# Altium schematic sheet uc.SchDoc
size A3; Organization: EPI sarl; Address1: 153 rue d'Altorf; Address2: 67120; Address3: Dachstein; Address4: France; SheetNumber: 1; SheetTotal: 2
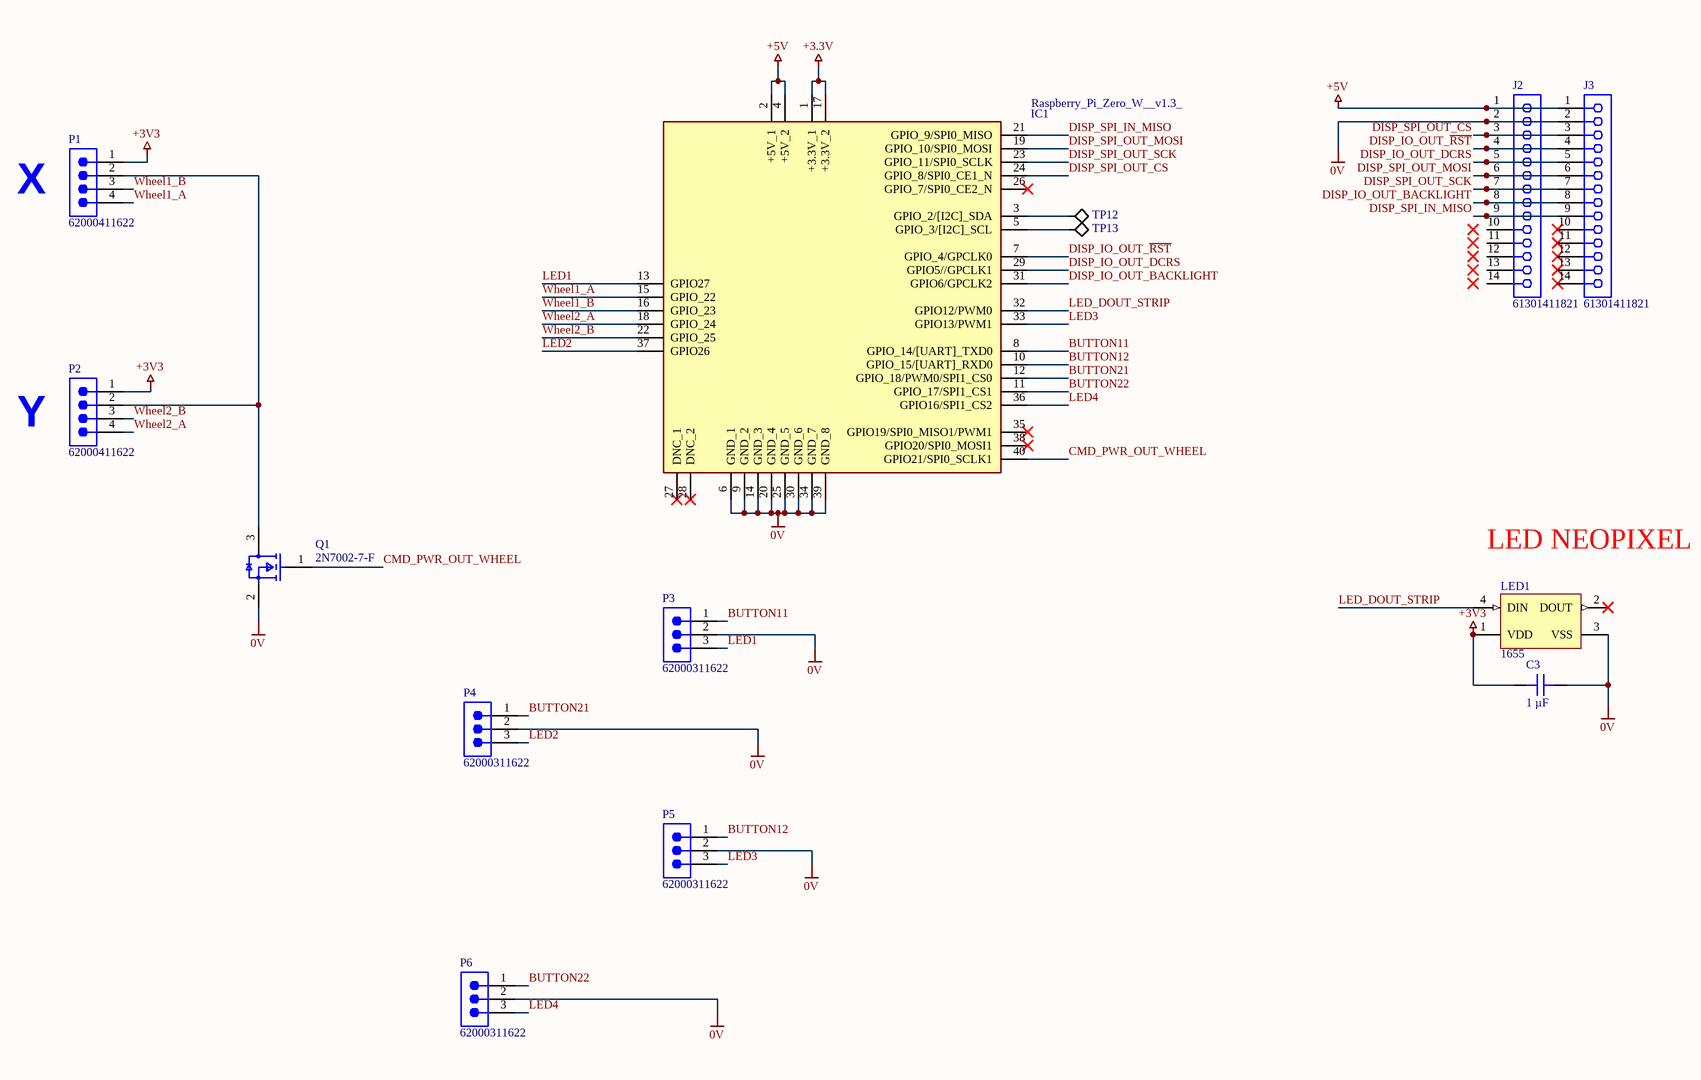
[diagram p0: uc.SchDoc]

## Parts
C3  1 µF  [CAP 0603_1608]
IC1  Raspberry_Pi_Zero_W__v1.3_  [RaspberryPiZero2W]
J2  61301411821  [61301411821]
J3  61301411821  [61301411821]
LED1  1655  [ADA-RGB-1655_V]
P1  62000411622  [62000411622]
P2  62000411622  [62000411622]
P3  62000311622  [62000311622]
P4  62000311622  [62000311622]
P5  62000311622  [62000311622]
P6  62000311622  [62000311622]
Q1  2N7002-7-F  [FP-SOT23-MFG]
TP12  Test Point  [TESTPOINT_ROUND_2.0MM]  (value not drawn)  (no BOM)
TP13  Test Point  [TESTPOINT_ROUND_2.0MM]  (value not drawn)  (no BOM)

## Nets
0V: C3.1 IC1.6(GND_1) IC1.9(GND_2) IC1.14(GND_3) IC1.20(GND_4) IC1.25(GND_5) IC1.30(GND_6) IC1.34(GND_7) IC1.39(GND_8) J2.2 J3.2 LED1.3(VSS) P3.2 P4.2 P5.2 P6.2 Q1.2(S)
+3.3V: IC1.1(+3.3V_1) IC1.17(+3.3V_2)
+3V3: C3.2 LED1.1(VDD) P1.1 P2.1
+5V: IC1.2(+5V_1) IC1.4(+5V_2) J2.1 J3.1
BUTTON11: IC1.8(GPIO_14/[UART]_TXD0) P3.1
BUTTON12: IC1.10(GPIO_15/[UART]_RXD0) P5.1
BUTTON21: IC1.12(GPIO_18/PWM0/SPI1_CS0) P4.1
BUTTON22: IC1.11(GPIO_17/SPI1_CS1) P6.1
CMD_PWR_OUT_WHEEL: IC1.40(GPIO21/SPI0_SCLK1) Q1.1(G)
DISP_IO_OUT_BACKLIGHT: IC1.31(GPIO6/GPCLK2) J2.8 J3.8
DISP_IO_OUT_DCRS: IC1.29(GPIO5//GPCLK1) J2.5 J3.5
DISP_IO_OUT_~{RST}: IC1.7(GPIO_4/GPCLK0) J2.4 J3.4
DISP_SPI_IN_MISO: IC1.21(GPIO_9/SPI0_MISO) J2.9 J3.9
DISP_SPI_OUT_CS: IC1.24(GPIO_8/SPI0_CE1_N) J2.3 J3.3
DISP_SPI_OUT_MOSI: IC1.19(GPIO_10/SPI0_MOSI) J2.6 J3.6
DISP_SPI_OUT_SCK: IC1.23(GPIO_11/SPI0_SCLK) J2.7 J3.7
LED1: IC1.13(GPIO27) P3.3
LED2: IC1.37(GPIO26) P4.3
LED3: IC1.33(GPIO13/PWM1) P5.3
LED4: IC1.36(GPIO16/SPI1_CS2) P6.3
LED_DOUT_STRIP: IC1.32(GPIO12/PWM0) LED1.4(DIN)
Wheel1_A: IC1.15(GPIO_22) P1.4
Wheel1_B: IC1.16(GPIO_23) P1.3
Wheel2_A: IC1.18(GPIO_24) P2.4
Wheel2_B: IC1.22(GPIO_25) P2.3
NetIC1_3: IC1.3(GPIO_2/[I2C]_SDA) TP12.1(TP)
NetIC1_5: IC1.5(GPIO_3/[I2C]_SCL) TP13.1(TP)
NetP1_2: P1.2 P2.2 Q1.3(D)

Not connected (* = marked no-connect by the designer): IC1 26(GPIO_7/SPI0_CE2_N)* 27(DNC_1)* 28(DNC_2)* 35(GPIO19/SPI0_MISO1/PWM1)* 38(GPIO20/SPI0_MOSI1)*; J2 10 11 12 13 14; J3 10* 11* 12* 13* 14*; LED1 2(DOUT)*

## Notes on the sheet
- (near P1) X
- (near P2) Y
- (near LED1) LED NEOPIXEL
- Unless otherwise noted, this document contains EPI® technologies information.
- Exclusive Property of EPI®
- File :
- Size:
- Date:
- A3
- Ref :
- Sheet
- of
- Reproduction, use, disclosure or transmittal of all or any part of this document is prohibited except to the explicit approved in writing by EPI® representative.
- Project :

## Library data of the parts
C3 = GCM188R71C105KA64J: CAP CER 1UF 16V X7R 0603; manufacturer: Murata Electronics; Tolerance: ±10%; Part Number: GCM188R71C105KA64J; Value: 1 µF; Applications: Automotive; Capacitance: 1 µF; componentlink1description: Datasheet; componentlink1url: https://www.murata.com/~/media/webrenewal/support/library/catalog/products/capacitor/mlcc/c03e.ashx?la=en-us; componentlink2description: DigiKey Link; componentlink2url: https://www.digikey.com/en/products/detail/murata-electronics/GCM188R71C105KA64J/4903955; Device Package: 0603 (1608 Metric); lastupdated: 08/03/2023 20:08:24; Lifecycle Status: Active; Minimum Order: 1; Mounting Type: Surface Mount, MLCC; Operating Temperature: -55°C ~ 125°C; Package / Case: 0603 (1608 Metric); packaging: TapeAndReel; partid: 13992; Part Status: Active; price: 0.02; Ratings: AEC-Q200; series: GCM; Size / Dimension: 0.063" L x 0.031" W (1.60mm x 0.80mm); Supplier 1: DigiKey; Supplier Part Number 1: 490-12657-1-ND; Temperature Coefficient: X7R; Thickness (Max): 0.035" (0.90mm); Voltage - Rated: 16V
IC1 = Raspberry_Pi_Zero_W__v1.3_: Integrated Circuit; Manufacturer_Name: RASPBERRY-PI; Manufacturer_Part_Number: Raspberry Pi Zero W (v1.3); Datasheet Link: https://cdn.sparkfun.com/assets/learn_tutorials/6/7/6/PiZero_1.pdf
J2 J3 = CMP-1502-01341-2: NexarPartId: 61924734; Gender: Female; Current Rating: 3A; Operating Supply Voltage: 250V; Contact Resistance: 20mΩ; RoHS: Non-Compliant; Number of Pins: 14; Orientation: Vertical; Lead Pitch: 2.54mm
LED1 = CMP-2000-05026-1: Intelligent Control LED Integrated Light Source, 3.5 to 5.3 V, -25 to 80 degC, 4-Pin SMD, RoHS, Tape and Reel; Manufacturer: Adafruit-Industries-LLC; Number of LEDs: 10; Configuration: Discrete; Utilized LED: WS2812(5050); Color: Red,Green,Blue(RGB); Datasheet URL: http://datasheet.octopart.com/ADA1655-Adafruit-Industries-datasheet-32028139.pdf; Series: Neopixel; Interface: -; Package Description: 4-Pin Surface Mount Device, Body 5 x 5 mm; Category: Optoelectronics; Controller Type: -; Package Reference: 1655; Manufacturer URL: https://www.adafruit.com/; Mounting Type: SurfaceMount; Datasheet Version: May-13; Size / Dimension: 5.00mmLx5.00mmW; Family: Addressable,Specialty
P1 P2 = CMP-1502-00644-2: NexarPartId: 116664071; Gender: Male; Insulation Resistance: 1GΩ; Pitch: 2mm; Current Rating: 2A; RoHS: Compliant; Max Operating Temperature: 85°C; Length: 10mm; Min Operating Temperature: -25°C; Contact Plating: Tin; Number of Pins: 4
P3-P6 = CMP-1502-00643-2: NexarPartId: 116664069; Insulation Resistance: 1GΩ; Current Rating: 2A; Pitch: 2mm; Gender: Male; RoHS: Compliant; Number of Pins: 3; Min Operating Temperature: -25°C; Contact Plating: Tin; Length: 8mm; Max Operating Temperature: 85°C
Q1 = CMP-2000-04929-2: MOSFET N-CH 60V 115MA SOT23-3; Turn-On Delay Time: 7ns; Turn-Off Delay Time: 11ns; Drain to Source Resistance: 7.5R; Rise Time: 3ns; Drain to Source Breakdown Voltage: 70V; Input Capacitance: 50pF; Number of Elements: 1; Power Dissipation: 540mW; Max Power Dissipation: 300mW; Fall Time: 5.6ns; Gate to Source Voltage (Vgs): 20V; Threshold Voltage: 2.5V; Element Configuration: Single; Termination: SMD/SMT; Weight: 0.000282oz; Radiation Hardening: No; Max Operating Temperature: 150°C; On-State Resistance: 7.5R; Mount: Surface Mount; Current Rating: 115mA; Contact Plating: Tin; Lead Free: Lead Free; Min Operating Temperature: -55°C; Number of Pins: 3; REACH SVHC: No SVHC; Drain to Source Voltage (Vdss): 60V; Width: 1.3mm; Package Quantity: 3000; Length: 2.9mm; Case/Package: SOT-23; Number of Channels: 1; Dual Supply Voltage: 60V; Packaging: Tape and Reel; Height: 1mm; Voltage Rating (DC): 60V; Nominal Vgs: 2.5V; Continuous Drain Current (ID): 115mA; Voltage: 60V; Rds On Max: 7.5R
TP12 TP13 = TEST_POINT_2MM